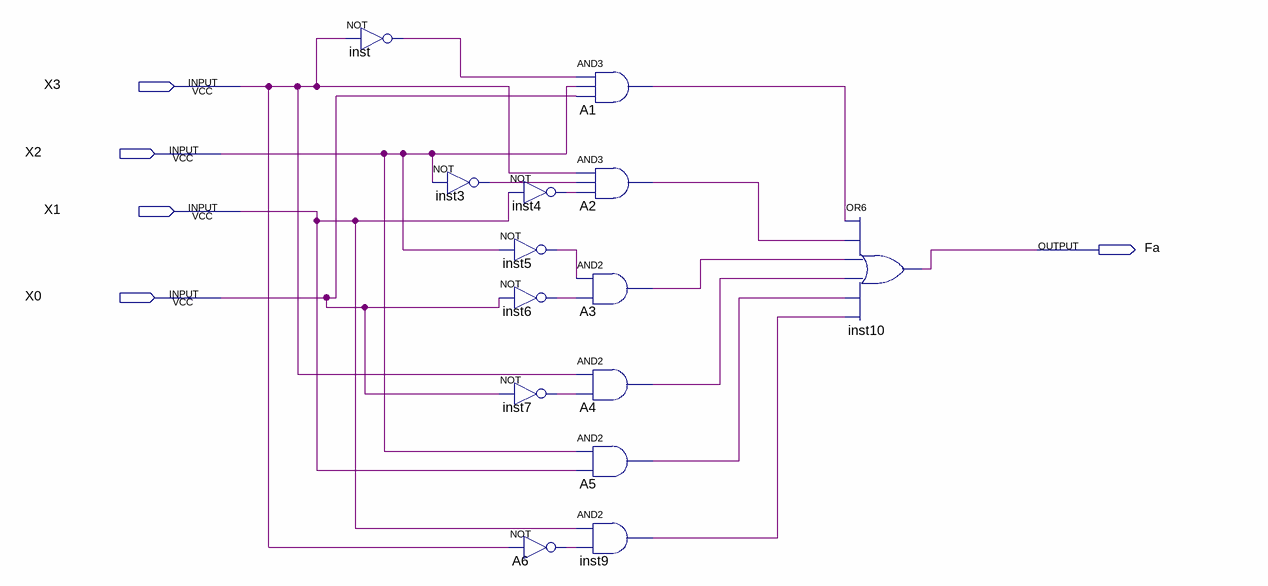
[diagram p0: schematic sheet]
// Quartus schematic Segmento1.bdf as structural Verilog: 14 symbols, 5 pins
module Segmento1 (
  input  X3,
  input  X2,
  input  X1,
  input  X0,
  output Fa
);

  wire A1_out, A2_out, A3_out, A4_out, A5_out, A6_out, inst3_out, inst4_out, inst5_out, inst6_out, inst7_out,
       inst9_out, inst_out;

  not inst (inst_out, X3);
  not inst3 (inst3_out, X2);
  not inst4 (inst4_out, X1);
  not inst5 (inst5_out, X2);
  not inst6 (inst6_out, X0);
  not inst7 (inst7_out, X0);
  not A6 (A6_out, X3);
  and A1 (A1_out, inst_out, X2, X0);
  and A2 (A2_out, X3, inst3_out, inst4_out);
  and A3 (A3_out, inst5_out, inst6_out);
  and A4 (A4_out, X3, inst7_out);
  and A5 (A5_out, X2, X1);
  and inst9 (inst9_out, X1, A6_out);
  or inst10 (Fa, A1_out, A2_out, A3_out, A4_out, A5_out, inst9_out);
endmodule
